# EAGLE board RouterPi (EAGLE 9.6.2)
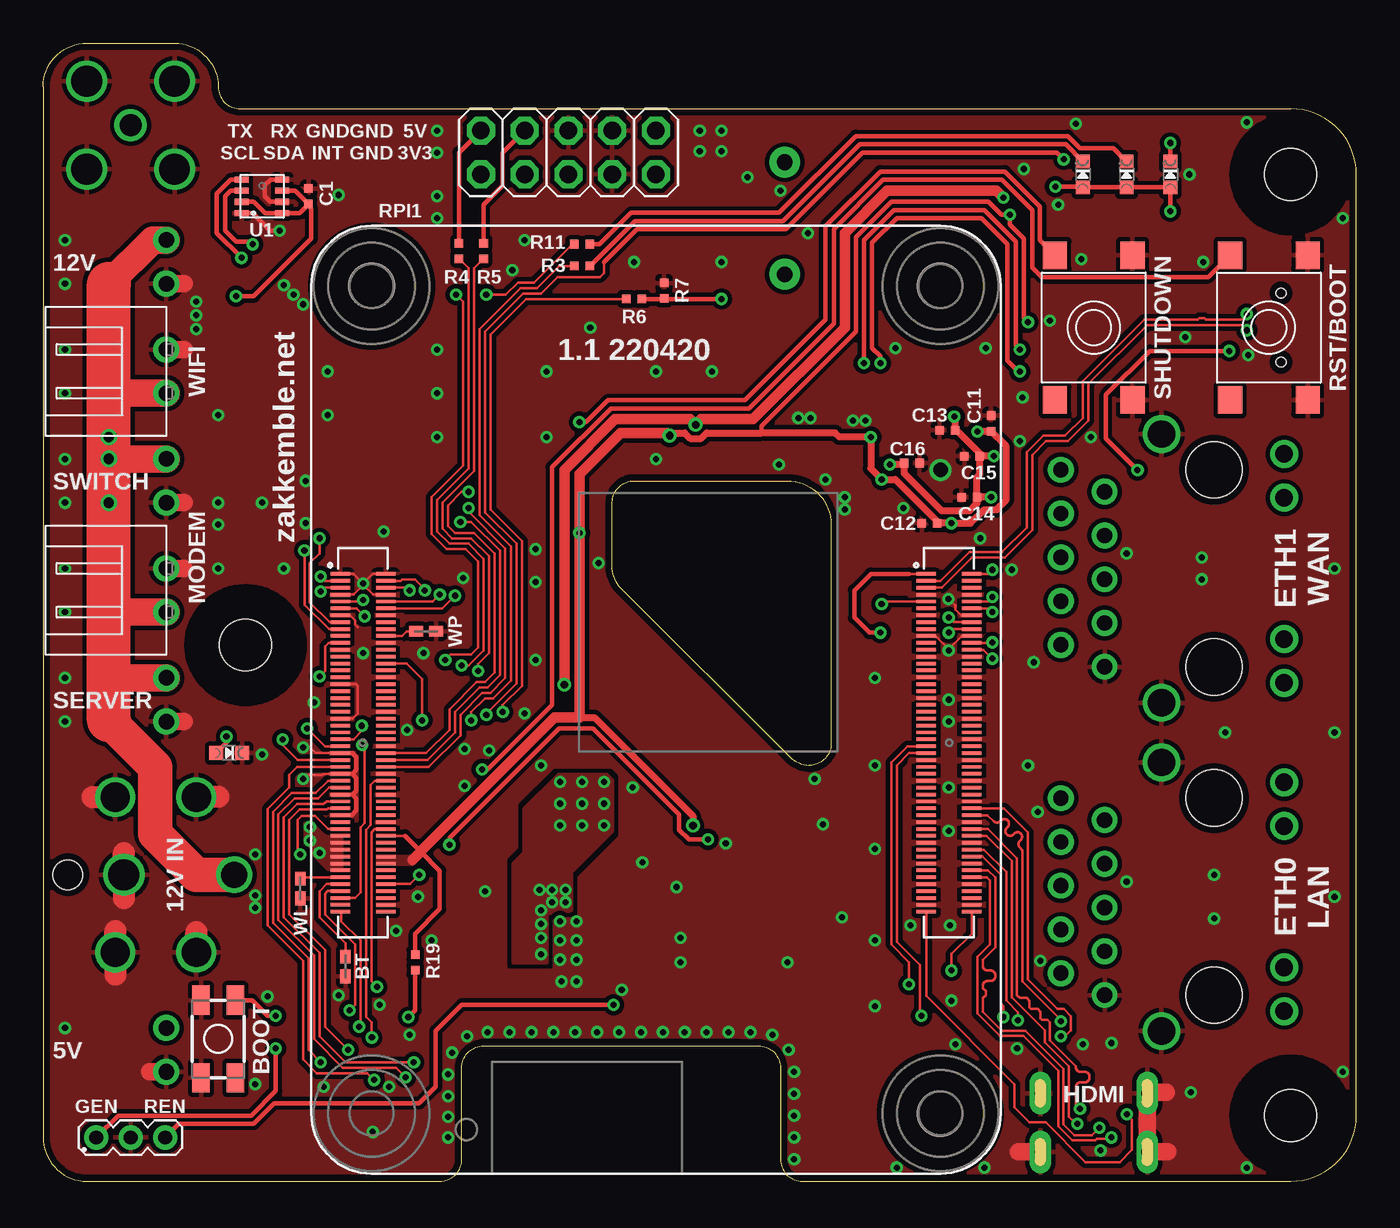
[diagram p2: board, top side]
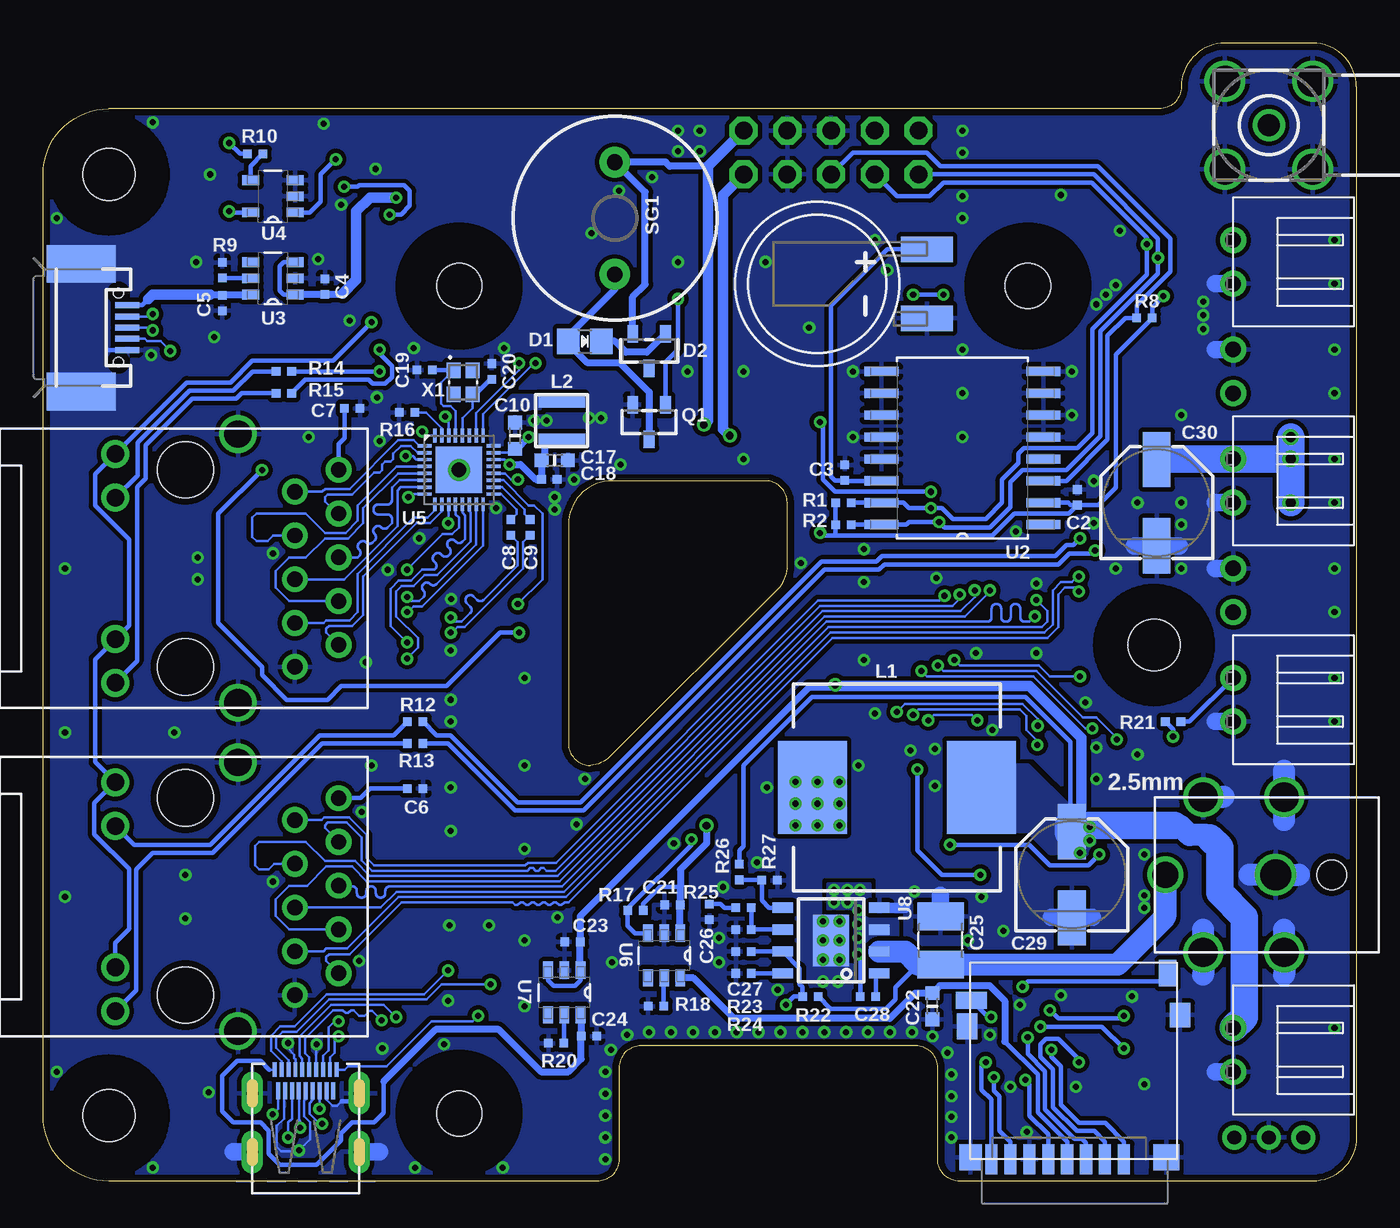
[diagram p3: board, bottom side, seen from below]

Size 76.2 x 66.04 mm. Coordinates in mm from the lower left corner, seen from the top.
Outline: 0,2.54 arc90 2.54,0 23.02,0 arc90 24.29,1.27 24.29,6.59 arc-90 25.56,7.86 41.51,7.86 arc-90 42.78,6.59 42.78,1.27 arc90 44.05,0 72.39,0 arc90 76.2,3.81 76.2,58.42 arc90 72.39,62.23 11.43,62.23 arc-90 10.16,63.5 arc90 7.62,66.04 2.54,66.04 arc90 0,63.5 0,2.54
Outline: 33.02,39.37 arc-90 34.29,40.64 43.18,40.64 arc-90 45.72,38.1 45.72,25.4 arc-90 44.45,24.13 arc-45 43.18,24.77 33.66,34.29 arc-45 33.02,35.56 33.02,39.37
Copper layers (1*16): Top 0.0356mm / dielectric 1.5011mm / Bottom 0.0356mm
Design rules "LaenPCBOrder *": minimum track width 6mil, minimum drill 13mil, track to track 6mil, track to pad 6mil, pad to pad 6mil, via to via 6mil, smd to smd 6mil, copper to edge 15mil, drill to drill 6mil, minimum pad ring 12mil, minimum via ring 7mil, stop-mask expansion 4mil, vias tented up to drill 24mil, thermal gap 10mil
Holes 3 mm at 72.39,58.42 11.75,31.11 72.39,3.81
Holes 2.6 mm at 52.06,3.94 19.06,51.94 52.06,51.94
tRestrict: area 69.2,55.2 to 75.6,61.6; area 8.6,27.9 to 14.9,34.3; area 69.2,0.6 to 75.6,7; area 25.4,0 to 40.4,8; area 48.7,0.6 to 55.4,7.3; area 15.7,48.6 to 22.4,55.3; area 48.7,48.6 to 55.4,55.3
bRestrict: area 69.2,55.2 to 75.6,61.6; area 8.6,27.9 to 14.9,34.3; area 69.2,0.6 to 75.6,7; area 25.4,0 to 40.4,8; area 48.7,0.6 to 55.4,7.3; area 15.7,48.6 to 22.4,55.3; area 48.7,48.6 to 55.4,55.3

## Footprints (pad centres in the part's own frame; a part is rotated, then mirrored left to right if it is on the bottom)
BATTERY_CR927 = smd 1.5 x 3: B+ 2,-6.35; B- -2,-6.35
0402_XSMALL = smd 0.5 x 0.5: 1 -0.45,0; 2 0.45,0
_0603MP = smd 0.8 x 0.8: 1 -0.762,0; 2 0.762,0
1210K = smd 1.6 x 2.7: 1 -1.4,0; 2 1.4,0
PANASONIC_D = smd 3.2 x 1.6: + 2.5,0; - -2.5,0
0805_DIODE = smd 1.3 x 1.5: 1 -0.95,0; 2 0.95,0
SOT-23-SLIMPAD = smd 0.635 x 1.016: 1 -0.95,-1; 2 0.95,-1; 3 0,1
JUMPER_SMALL = smd 0.8 x 0.6: 1 -0.577,0; 2 0.577,0
POWER_JACK_PTH_HIGHCURRENT = drill 1.7: C1 -4.5,4.7; C2 -4.5,0; C3 4.5,4.7; C4 4.5,0 | drill 1.8: GND 0,4.2 | drill 1.5: PWR 0,-2.2 | hole 1.7: 0,7.45
2WAY = drill 0.9: P$1 -1.27,0; P$2 1.27,0
2X05 = drill 1.016 octagon: 1 -5.08,-1.27; 2 -5.08,1.27; 3 -2.54,-1.27; 4 -2.54,1.27; 5 0,-1.27; 6 0,1.27; 7 2.54,-1.27; 8 2.54,1.27; 9 5.08,-1.27; 10 5.08,1.27
HEADER_2.0_3WAY = drill 0.8: 1 -2,0; 2 0,0; 3 2,0
RJ45_MAG_MOLEX_93626 = drill 0.89: 1 -5.72,19.69; 2 -4.45,17.15; 3 -3.18,19.69; 4 -1.91,17.15; 5 -0.64,19.69; 6 0.63,17.15; 7 1.9,19.69; 8 3.17,17.15; 9 4.44,19.69; 10 5.71,17.15 | drill 1.02: 11 -6.64,6.73; 12 -4.1,6.73; 13 4.1,6.73; 14 6.64,6.73 | drill 1.58: TAB1 -7.795,13.85; TAB2 7.795,13.85 | hole 3.26: -5.72,10.8; 5.71,10.8
HDMI_MICRO2 = smd 0.23 x 0.85: 1 1.8,6.475; 3 1.4,6.475; 5 1,6.475; 7 0.6,6.475; 9 0.2,6.475; 11 -0.2,6.475; 13 -0.6,6.475; 15 -1,6.475; 17 -1.4,6.475; 19 -1.8,6.475 | smd 0.23 x 1: 2 1.6,5.25; 4 1.2,5.25; 6 0.8,5.25; 8 0.4,5.25; 10 0,5.25; 12 -0.4,5.25; 14 -0.8,5.25; 16 -1.2,5.25; 18 -1.6,5.25 | drill 0.65 long: TAB1 -3.1,5.11; TAB2 3.1,5.11; TAB3 -3.1,1.7; TAB4 3.1,1.7
BU-SMA-H = drill 1.27: 1 0,0 | drill 1.778: 2 -2.55,2.55; 3 2.55,2.55; 4 2.55,-2.55; 5 -2.55,-2.55
CDRH125 = smd 5.4 x 4: 1 0,4.9; 2 0,-4.9
INDUCTOR_3X3MM_SM = smd 0.8 x 2.7: P$1 -1.15,0; P$2 1.15,0
CHIPLED_0603_NOOUTLINE = smd 0.8 x 0.8: A 0,-0.75; C 0,0.75
SOT23-R = smd 0.635 x 1.016: 1 -0.95,-1; 2 0.95,-1; 3 0,1
RPI_CM4 = smd 0.2 x 1.14: 1 7.3,18.32; 2 7.3,15.68; 3 6.9,18.32; 4 6.9,15.68; 5 6.5,18.32; 6 6.5,15.68; 7 6.1,18.32; 8 6.1,15.68; 9 5.7,18.32; 10 5.7,15.68; 11 5.3,18.32; 12 5.3,15.68; 13 4.9,18.32; 14 4.9,15.68; 15 4.5,18.32; 16 4.5,15.68; 17 4.1,18.32; 18 4.1,15.68; 19 3.7,18.32; 20 3.7,15.68; 21 3.3,18.32; 22 3.3,15.68; 23 2.9,18.32; 24 2.9,15.68; 25 2.5,18.32; 26 2.5,15.68; 27 2.1,18.32; 28 2.1,15.68; 29 1.7,18.32; 30 1.7,15.68; 31 1.3,18.32; 32 1.3,15.68; 33 0.9,18.32; 34 0.9,15.68; 35 0.5,18.32; 36 0.5,15.68; 37 0.1,18.32; 38 0.1,15.68; 39 -0.3,18.32; 40 -0.3,15.68; 41 -0.7,18.32; 42 -0.7,15.68; 43 -1.1,18.32; 44 -1.1,15.68; 45 -1.5,18.32; 46 -1.5,15.68; 47 -1.9,18.32; 48 -1.9,15.68; 49 -2.3,18.32; 50 -2.3,15.68; 51 -2.7,18.32; 52 -2.7,15.68; 53 -3.1,18.32; 54 -3.1,15.68; 55 -3.5,18.32; 56 -3.5,15.68; 57 -3.9,18.32; 58 -3.9,15.68; 59 -4.3,18.32; 60 -4.3,15.68; 61 -4.7,18.32; 62 -4.7,15.68; 63 -5.1,18.32; 64 -5.1,15.68; 65 -5.5,18.32; 66 -5.5,15.68; 67 -5.9,18.32; 68 -5.9,15.68; 69 -6.3,18.32; 70 -6.3,15.68; 71 -6.7,18.32; 72 -6.7,15.68; 73 -7.1,18.32; 74 -7.1,15.68; 75 -7.5,18.32; 76 -7.5,15.68; 77 -7.9,18.32; 78 -7.9,15.68; 79 -8.3,18.32; 80 -8.3,15.68; 81 -8.7,18.32; 82 -8.7,15.68; 83 -9.1,18.32; 84 -9.1,15.68; 85 -9.5,18.32; 86 -9.5,15.68; 87 -9.9,18.32; 88 -9.9,15.68; 89 -10.3,18.32; 90 -10.3,15.68; 91 -10.7,18.32; 92 -10.7,15.68; 93 -11.1,18.32; 94 -11.1,15.68; 95 -11.5,18.32; 96 -11.5,15.68; 97 -11.9,18.32; 98 -11.9,15.68; 99 -12.3,18.32; 100 -12.3,15.68; 101 7.3,-15.68; 102 7.3,-18.32; 103 6.9,-15.68; 104 6.9,-18.32; 105 6.5,-15.68; 106 6.5,-18.32; 107 6.1,-15.68; 108 6.1,-18.32; 109 5.7,-15.68; 110 5.7,-18.32; 111 5.3,-15.68; 112 5.3,-18.32; 113 4.9,-15.68; 114 4.9,-18.32; 115 4.5,-15.68; 116 4.5,-18.32; 117 4.1,-15.68; 118 4.1,-18.32; 119 3.7,-15.68; 120 3.7,-18.32; 121 3.3,-15.68; 122 3.3,-18.32; 123 2.9,-15.68; 124 2.9,-18.32; 125 2.5,-15.68; 126 2.5,-18.32; 127 2.1,-15.68; 128 2.1,-18.32; 129 1.7,-15.68; 130 1.7,-18.32; 131 1.3,-15.68; 132 1.3,-18.32; 133 0.9,-15.68; 134 0.9,-18.32; 135 0.5,-15.68; 136 0.5,-18.32; 137 0.1,-15.68; 138 0.1,-18.32; 139 -0.3,-15.68; 140 -0.3,-18.32; 141 -0.7,-15.68; 142 -0.7,-18.32; 143 -1.1,-15.68; 144 -1.1,-18.32; 145 -1.5,-15.68; 146 -1.5,-18.32; 147 -1.9,-15.68; 148 -1.9,-18.32; 149 -2.3,-15.68; 150 -2.3,-18.32; 151 -2.7,-15.68; 152 -2.7,-18.32; 153 -3.1,-15.68; 154 -3.1,-18.32; 155 -3.5,-15.68; 156 -3.5,-18.32; 157 -3.9,-15.68; 158 -3.9,-18.32; 159 -4.3,-15.68; 160 -4.3,-18.32; 161 -4.7,-15.68; 162 -4.7,-18.32; 163 -5.1,-15.68; 164 -5.1,-18.32; 165 -5.5,-15.68; 166 -5.5,-18.32; 167 -5.9,-15.68; 168 -5.9,-18.32; 169 -6.3,-15.68; 170 -6.3,-18.32; 171 -6.7,-15.68; 172 -6.7,-18.32; 173 -7.1,-15.68; 174 -7.1,-18.32; 175 -7.5,-15.68; 176 -7.5,-18.32; 177 -7.9,-15.68; 178 -7.9,-18.32; 179 -8.3,-15.68; 180 -8.3,-18.32; 181 -8.7,-15.68; 182 -8.7,-18.32; 183 -9.1,-15.68; 184 -9.1,-18.32; 185 -9.5,-15.68; 186 -9.5,-18.32; 187 -9.9,-15.68; 188 -9.9,-18.32; 189 -10.3,-15.68; 190 -10.3,-18.32; 191 -10.7,-15.68; 192 -10.7,-18.32; 193 -11.1,-15.68; 194 -11.1,-18.32; 195 -11.5,-15.68; 196 -11.5,-18.32; 197 -11.9,-15.68; 198 -11.9,-18.32; 199 -12.3,-15.68; 200 -12.3,-18.32
MICROSD = smd 0.7 x 1.75: 1 8.9,0; 2 7.8,0; 3 6.7,0; 4 5.6,0; 5 4.5,0; 6 3.4,0; 7 2.3,0; 8 1.2,0 | smd 1.8 x 1: CD1 0.05,9.225 | smd 1 x 1.55: CD2 11.43,10.8 | smd 1.2 x 1.5: G1 -0.2,7.725 | smd 1.2 x 1.4: G2 12.15,8.375 | smd 1.3 x 1.5: G3 0,0.125 | smd 1.5 x 1.5: G4 11.35,0.125
BUZZER-12MM = drill 0.9 pad 1.778: + 3.25,0; - -3.25,0
TACT_SMD4 = smd 1.6 x 1.4: A -4.2,-2.25; A' 4.2,-2.25; B -4.2,2.25; B' 4.2,2.25
TACT_SMD5 = smd 1.7 x 1: 1 -2.25,1; 2 2.25,1; 3 -2.25,-1; 4 2.25,-1
BME280 = smd 0.8 x 0.35: 1 1.175,0.975; 2 1.175,0.325; 3 1.175,-0.325; 4 1.175,-0.975; 5 -1.175,-0.975; 6 -1.175,-0.325; 7 -1.175,0.325; 8 -1.175,0.975
SOIC127P1032X265-16N = smd 1.981 x 0.533: 1 -4.699,4.445; 2 -4.699,3.175; 3 -4.699,1.905; 4 -4.699,0.635; 5 -4.699,-0.635; 6 -4.699,-1.905; 7 -4.699,-3.175; 8 -4.699,-4.445; 9 4.699,-4.445; 10 4.699,-3.175; 11 4.699,-1.905; 12 4.699,-0.635; 13 4.699,0.635; 14 4.699,1.905; 15 4.699,3.175; 16 4.699,4.445
SOT23-6_SM_PAD = smd 1 x 0.56: 1 -1.295,0.94; 2 -1.295,0; 3 -1.295,-0.94; 4 1.295,-0.94; 5 1.295,0; 6 1.295,0.94
SOT23-5_SM_PAD = smd 1 x 0.56: 1 -1.295,0.94; 2 -1.295,0; 3 -1.295,-0.94; 4 1.295,-0.94; 5 1.295,0.94
QFN32-4X4-0.4 = smd 0.8 x 0.2: 1 -2,1.4; 2 -2,1; 3 -2,0.6; 4 -2,0.2; 5 -2,-0.2; 6 -2,-0.6; 7 -2,-1; 8 -2,-1.4; 17 2,-1.4; 18 2,-1; 19 2,-0.6; 20 2,-0.2; 21 2,0.2; 22 2,0.6; 23 2,1; 24 2,1.4 | smd 0.2 x 0.8: 9 -1.4,-2; 10 -1,-2; 11 -0.6,-2; 12 -0.2,-2; 13 0.2,-2; 14 0.6,-2; 15 1,-2; 16 1.4,-2; 25 1.4,2; 26 1,2; 27 0.6,2; 28 0.2,2; 29 -0.2,2; 30 -0.6,2; 31 -1,2; 32 -1.4,2 | smd 2.7 x 2.7: EXP 0,0
SOIC8_150MIL_EXPPAD = smd 0.6 x 1.2: 1 -1.905,-2.8; 2 -0.635,-2.8; 3 0.635,-2.8; 4 1.905,-2.8; 5 1.905,2.8; 6 0.635,2.8; 7 -0.635,2.8; 8 -1.905,2.8 | smd 3 x 2.1: EXPPAD 0,0
USB-MICROB_LARGEPAD = smd 0.35 x 1.4: D+ 0,2.65; D- -0.65,2.65; GND 1.3,2.65; ID 0.65,2.65; VBUS -1.3,2.65 | smd 2.2 x 4: MT1 -3.7,0; MT2 3.7,0 | hole 0.55: -2,2.15; 2,2.15
2016_XTAL = smd 0.9 x 0.8: 1 -0.7,-0.55; 2 0.7,-0.55; 3 0.7,0.55; 4 -0.7,0.55

## Placement (x,y rotation side)
BATT1  [BATTERY_CR927]  31.27,52.07 90 bottom
C1  100n  [0402_XSMALL]  15.4,57.15 90 top
C2  100n  [0402_XSMALL]  16.19,39.69 90 bottom
C3  100n  [0402_XSMALL]  29.69,41.12 90 bottom
C4  100n  [0402_XSMALL]  59.85,51.91 90 bottom
C5  100n  [0402_XSMALL]  65.8,50.96 270 bottom
C6  100n  [0402_XSMALL]  54.61,22.78 0 bottom
C7  100n  [0402_XSMALL]  58.26,44.85 0 bottom
C8  100n  [0402_XSMALL]  49.05,37.94 90 bottom
C9  100n  [0402_XSMALL]  47.94,37.94 90 bottom
C10  4u7  [_0603MP]  48.82,43.26 90 bottom
C11  100n  [0402_XSMALL]  55.01,43.97 90 top
C12  100n  [0402_XSMALL]  51.43,38.18 180 top
C13  100n  [0402_XSMALL]  52.47,43.58 180 top
C14  100n  [0402_XSMALL]  53.74,39.69 180 top
C15  100n  [0402_XSMALL]  53.9,42.07 180 top
C16  100n  [0402_XSMALL]  50.4,41.67 0 top
C17  4u7  [_0603MP]  46.51,41.83 0 bottom
C18  100n  [0402_XSMALL]  46.83,40.72 0 bottom
C19  6p8  [0402_XSMALL]  54.05,47.07 180 bottom
C20  6p8  [0402_XSMALL]  50.16,46.99 90 bottom
C21  100n  [0402_XSMALL]  39.69,16.03 180 bottom
C22  4u7  [_0603MP]  24.61,10.16 270 bottom
C23  100n  [0402_XSMALL]  45.48,13.89 180 bottom
C24  100n  [0402_XSMALL]  44.53,8.41 0 bottom
C25  22u  [1210K]  24.13,13.97 90 bottom
C26  1n  [0402_XSMALL]  37.54,15.64 270 bottom
C27  33p  [0402_XSMALL]  35.56,14.61 180 bottom
C28  100n  [0402_XSMALL]  28.34,10.72 180 bottom
C29  270u  [PANASONIC_D]  16.51,17.78 90 bottom
C30  270u  [PANASONIC_D]  11.59,39.37 90 bottom
D1  TS4148  [0805_DIODE]  44.77,48.74 0 bottom
D2  15V  [SOT-23-SLIMPAD]  41.04,48.18 180 bottom
J2  [JUMPER_SMALL]  14.92,16.99 90 top
J3  [JUMPER_SMALL]  17.54,12.46 90 top
J4  [JUMPER_SMALL]  22.23,31.91 180 top
JP1  [POWER_JACK_PTH_HIGHCURRENT]  8.89,17.78 270 bottom
JP2  [2WAY]  7.14,27.94 270 bottom
JP3  [2WAY]  7.14,34.29 90 top
JP4  [2WAY]  7.14,40.64 270 bottom
JP5  [2WAY]  7.14,46.99 90 top
JP6  [2WAY]  7.14,53.34 270 bottom
JP7  [2WAY]  7.14,7.62 270 bottom
JP8  [2X05]  30.48,59.69 0 top
JP9  [HEADER_2.0_3WAY]  5.08,2.54 0 top
JP10  [RJ45_MAG_MOLEX_93626]  78.74,16.51 270 bottom
JP11  [RJ45_MAG_MOLEX_93626]  78.74,35.56 270 bottom
JP12  [HDMI_MICRO2]  60.96,0 0 bottom
JP13  BU-SMA-H  [BU-SMA-H]  5.08,61.28 0 bottom
L1  18u  [CDRH125]  26.67,22.86 90 bottom
L2  2u2  [INDUCTOR_3X3MM_SM]  46.12,44.13 90 bottom
LED1  [CHIPLED_0603_NOOUTLINE]  60.32,58.42 0 top
LED2  [CHIPLED_0603_NOOUTLINE]  65.41,58.42 0 top
LED3  [CHIPLED_0603_NOOUTLINE]  62.87,58.42 0 top
LED4  [CHIPLED_0603_NOOUTLINE]  10.79,24.84 270 top
Q1  BC817-40  [SOT23-R]  41.04,44.05 180 bottom
R1  10k  [0402_XSMALL]  29.77,39.37 180 bottom
R2  10k  [0402_XSMALL]  29.77,38.1 180 bottom
R3  1k  [0402_XSMALL]  31.27,53.1 0 top
R4  1k  [0402_XSMALL]  24.13,53.98 270 top
R5  1k  [0402_XSMALL]  25.56,53.98 270 top
R6  2k2  [0402_XSMALL]  34.29,51.2 180 top
R7  47k  [0402_XSMALL]  36.04,51.67 90 top
R8  10k  [0402_XSMALL]  12.3,50.09 0 bottom
R9  22k  [0402_XSMALL]  65.8,52.86 90 bottom
R10  1k  [0402_XSMALL]  63.9,59.61 180 bottom
R11  1k  [0402_XSMALL]  31.27,54.37 0 top
R12  330  [0402_XSMALL]  54.61,26.67 0 bottom
R13  330  [0402_XSMALL]  54.61,25.4 0 bottom
R14  330  [0402_XSMALL]  62.23,46.99 0 bottom
R15  330  [0402_XSMALL]  62.23,45.72 0 bottom
R16  2k49  [0402_XSMALL]  55.09,44.61 0 bottom
R17  10k  [0402_XSMALL]  41.83,15.72 0 bottom
R18  22k  [0402_XSMALL]  40.64,10.16 180 bottom
R19  0R  [0402_XSMALL]  21.59,12.7 270 top
R20  43k  [0402_XSMALL]  46.43,8.02 180 bottom
R21  10k  [0402_XSMALL]  10.64,26.67 0 bottom
R22  220k  [0402_XSMALL]  31.67,10.72 0 bottom
R23  62k  [0402_XSMALL]  35.56,13.34 0 bottom
R24  180k  [0402_XSMALL]  35.56,12.06 0 bottom
R25  24k  [0402_XSMALL]  35.56,15.88 0 bottom
R26  120k  [0402_XSMALL]  35.8,17.94 90 bottom
R27  22k  [0402_XSMALL]  34.05,17.46 180 bottom
RPI1  [RPI_CM4]  35.56,27.94 90 top
SD1  MICROSD  [MICROSD]  22.38,1.27 0 bottom
SG1  [BUZZER-12MM]  43.02,55.88 90 bottom
SW1  [TACT_SMD4]  60.96,49.53 90 top
SW2  [TACT_SMD4]  71.12,49.53 90 top
SW3  [TACT_SMD5]  10.16,8.26 90 top
U1  BME280  [BME280]  12.7,57.15 180 top
U2  DS3231  [SOIC127P1032X265-16N]  22.86,42.55 180 bottom
U3  AP2553W6-7  [SOT23-6_SM_PAD]  62.87,52.39 180 bottom
U4  74LVC1G32W5-7  [SOT23-5_SM_PAD]  62.87,57.15 180 bottom
U5  RTL8111H  [QFN32-4X4-0.4]  52.07,41.27 0 bottom
U6  AP2553W6-7  [SOT23-6_SM_PAD]  40.16,13.1 270 bottom
U7  AP2553W6-7  [SOT23-6_SM_PAD]  45.96,10.95 270 bottom
U8  TPS54335A  [SOIC8_150MIL_EXPPAD]  30.48,13.97 90 bottom
USB1  USB-MICROBLARGEPAD  [USB-MICROB_LARGEPAD]  73.98,49.53 270 bottom
X1  25MHz  [2016_XTAL]  51.83,46.35 270 bottom

## Tracks (layer width: path | path; a pad name or v marks a point on that pad's centre or on a via)
3.3V  (via drill 0.35, 0.45)
  Top 0.152: RPI1.78 21,20.04
  Top 0.254: U1.2 12.23,56.83 12.88,56.17 U1.8 14.87,56.17 C1.1 | v57.15,49.85 56.91,50.09 56.91,54.69 56.09,55.51 v56.09,56.09 55.59,56.09 54.85,56.83 49.21,56.83 47.15,54.77 47.15,49.29 41.67,43.81 41.67,43.42 | v11.19,51.36 12.22,51.36 15.56,54.69 15.56,56.44 15.4,56.59 C1.1 | 21,20.04 21.87,19.17 21.87,19.09 | R19.1 21.59,14.37 23.02,15.8 23.02,18.02 21.91,19.13 | v58.74,57.71 60.29,57.71 LED1.A LED3.A LED2.A v65.41,56.28 | U1.6 14.62,57.48 C1.1
  Top 0.406: 36.2,43.42 37.23,43.42 37.54,43.1 38.18,43.1 38.5,43.42 41.67,43.42 45.96,43.42 46.2,43.18 v48.02,43.18 48.02,41.35 v48.66,40.72 49.45,40.72 51.88,38.28 C12.1 v52.7,38.18 53.82,38.18 54.61,38.97 55.32,38.97 55.88,39.53 55.88,42.65 C11.1 54.24,43.52 v54.21,43.5 | v37.7,20.64 37.7,21.19 31.99,26.91 31.12,26.91 31.04,26.91
  Top 0.61: v36.35,43.26 36.2,43.42 33.5,43.42 31.12,41.04 v31.12,37.62 31.12,26.91 | 21.43,18.65 21.87,19.09 21.91,19.13 29.69,26.91 31.04,26.91
  Bottom 0.152: U5.32 53.99,43.27 v54.21,43.5 | v52.7,38.18 52.67,38.21 U5.11 | v48.66,40.72 49.05,40.72 49.41,41.08 U5.20 | JP11.11 | JP10.11 | U5.23 49.04,42.27 C10.1
  Bottom 0.254: JP11.11 73.18,41.04 73.18,39.21 71.22,37.24 71.22,32.25 JP11.13 73.18,30.29 73.18,24.32 JP10.11 73.22,21.95 73.22,20.12 71.22,18.11 71.22,14.63 72.01,13.84 JP10.13 | JP11.11 67.86,46.35 65.33,46.35 64.06,47.62 59.37,47.62 v57.15,49.85 | v31.12,37.62 30.96,37.47 30.22,37.47 | 30.22,37.47 21.11,37.47 19.84,38.73 16.7,38.73 C2.1 | v56.09,56.09 55.43,56.09 54.93,56.59 54.93,57.47 55.24,57.78 57.86,57.78 57.94,57.71 v58.74,57.71 | 39.22,17.07 40.41,17.07 41.38,16.09 R17.2 | U4.5 65.34,56.21 v65.41,56.28 | C2.1 14.98,39.24 13.97,40.24 13.97,47.97 R8.2 11.85,50.69 v11.19,51.36 | C2.1 16.59,39.24 16.72,39.37 U2.2 | R1.2 R2.2 30.22,37.47
  Bottom 0.406: v37.7,20.64 37.7,19.61 39.22,18.09 39.22,17.07 39.22,16.05 C21.1 39.24,14.41 U6.1 | C10.1 48.7,42.5 v48.02,43.18
  Bottom 0.61: v36.35,43.26 36.75,43.66 36.75,57.23 JP8.9
  pour Top (rank 5, no thermals): 19.37,18.41 19.37,18.81 21.43,18.81 21.51,18.73 21.51,18.49 21.43,18.41
5.0V  (via drill 0.35, 0.45)
  Top 0.61: v30.24,28.81 30.24,41.27 33.18,44.21 37.54,44.21 v37.86,43.89 38.18,44.21 41.2,44.21 46.51,49.53 46.51,55.01 48.97,57.47 55.32,57.47 v55.72,57.07
  Bottom 0.152: 45.01,12.24 U7.1 | 61.58,53.34 U3.3
  Bottom 0.254: U7.3 46.9,11.65 46.59,11.35 45.32,11.35 45.01,11.67 45.01,12.24 | 15.95,21.59 16.59,20.95 16.59,25.48 19.21,28.1 31.59,28.1 35.56,24.13 35.56,19.44 35.8,19.2 R26.2 | U3.1 62.24,51.45 62.47,51.67 62.47,53.1 62.23,53.34 61.58,53.34 | SG1.+
  Bottom 0.406: v30.24,28.81 30.4,28.65 31.75,28.65 45.03,15.37 C23.1 45.03,12.26 U7.1 | 37.63,58.89 39.84,58.89 40.08,59.13 SG1.+ 41.27,57.39 41.27,52.04 41.99,51.32 D2.2 | U3.1 61.56,51.46 C4.1 58.87,51.46 58.82,51.51
  Bottom 0.61: 15.95,21.59 15.95,25.72 18.97,28.73 30.16,28.73 v30.24,28.81 | v37.86,43.89 37.63,44.13 37.63,58.89 JP8.10 | 58.82,51.51 58.02,52.31 58.02,56.28 57.23,57.07 v55.72,57.07
  Bottom 1.27: 8.49,19.92 8.65,20.08 9.68,20.08 10.24,20.64 10.56,20.64
  Bottom 1.6: JP7.P$1 6.51,9.53 6.51,15.32 7.94,16.75 7.94,19.37 8.49,19.92 | 10.56,20.64 16.51,20.64
  Bottom 2: 16.51,20.64 C29.+
  other vias: 15.48,20.56 15.48,19.76 16.03,19.05
  pour Bottom (rank 5, no thermals): 20.32,24.13 19.05,24.13 16.51,21.59 16.51,19.05 17.78,19.05 19.05,20.32 20.32,20.32
  pour Top (isolate 0.254, rank 4, no thermals): 17.3,20.88 17.3,18.02 16.67,18.02 15.24,19.45 15.24,20.88
  pour Bottom (isolate 0.254, rank 5, no thermals): 15.95,18.73 15.24,19.45 15.24,20.88 15.48,21.11 17.07,21.11 17.07,18.73
12V  (via drill 0.6)
  Top 1.6: 3.81,52.07 6.35,54.61 JP6.P$1 | JP5.P$1 3.81,45.72 | JP4.P$1 v3.81,41.91 | JP3.P$1 3.81,33.02 | JP2.P$1 3.81,29.21
  Top 2: JP1.PWR 8.89,17.78 6.51,20.16 6.51,24.05 3.81,26.75
  Top 2.54: 3.81,26.75 3.81,29.21 3.81,33.02 v3.81,41.91 3.81,45.72 3.81,52.07
  Bottom 0.254: 25.43,12.57 26.75,11.25 26.75,10.56 27.3,10 30.51,10 R22.2 | R21.2 9.68,26.67 JP2.P$1
  Bottom 1.27: U8.2 26.19,13.34 25.43,12.57 C25.1 13.86,12.57 11.09,15.34 JP1.PWR
  Bottom 1.6: C30.+ 11.55,41.91 JP4.P$1 v3.81,41.91 | v3.81,43.18 v3.81,41.91 | v3.81,39.37 v3.81,41.91
GND  (via drill 0.35, 0.85)
  Top 0.152: v15.08,23.34 15.32,23.57 16.19,23.57 16.26,23.64 RPI1.59 17.95,23.64 | RPI1.71 17.91,21.24 | RPI1.65 17.96,22.44 | v15.08,25.16 15.48,25.16 15.8,24.84 RPI1.53 17.94,24.84 | RPI1.114 53.28,32.84 52.93,33.19 52.93,33.39 v52.54,33.79 | RPI1.8 19.14,34.04 18.57,34.61 | 18.57,34.61 v18.57,34.69 | RPI1.7 18.01,34.04 18.57,34.61 | RPI1.43 17.95,26.84 18.26,27.15 18.26,28.73 18.15,28.84 RPI1.33 | RPI1.13 17.8,32.84 18.1,32.54 18.1,32.31 18.26,32.15 | RPI1.120 53.31,31.64 52.55,30.88 | 52.55,30.88 v52.55,30.8 | RPI1.119 51.78,31.64 52.55,30.88 | RPI1.1 18.02,35.24 v18.57,34.69 | RPI1.2 19.13,35.24 v18.57,34.69
  Top 0.254: U1.7 13.18,56.83 12.86,57.15 12.86,57.78 13.2,58.12 U1.5 | 17.91,21.24 18.18,21.51 18.18,22.23 17.96,22.44 18.18,22.66 18.18,23.42 17.95,23.64 18.18,23.86 18.18,24.61 17.94,24.84 | U1.1 12.17,56.17 13.18,55.17 v13.73,55.17
  Top 1.016: JP3.P$2 8.18,35.56 | JP4.P$2 8.18,39.37 | JP5.P$2 8.18,48.26 | JP6.P$2 8.18,52.07 | JP2.P$2 8.18,26.67 | JP7.P$2 6.19,6.35 | JP12.TAB4 56.59,1.7 | 65.17,5.16 64.06,5.16 JP12.TAB1 JP12.TAB3 65.25,1.7
  Top 1.27: 10.16,22.3 8.91,22.3 JP1.C2 | JP1.C4 8.89,14.45 | 4.69,16.43 JP1.GND 4.69,19.05 | 4.19,14.53 JP1.C3 4.19,11.99 | JP1.C1 2.86,22.28
  Bottom 0.152: 58.87,4.63 59.13,4.37 59.41,4.37 59.76,4.71 JP12.4 | JP12.7 60.36,7.9 v60.32,7.94 | JP12.13 61.56,7.08 61.62,7.14 61.62,7.33 61.99,7.7 v61.99,8.02 | JP12.10 60.96,4.75 61.05,4.65 61.05,3.77 60.7,3.42 60.7,2.45 v61.36,1.79 61.4,1.75 62.39,1.75 62.64,2 62.64,3.21 62.22,3.64 62.22,5.19 JP12.16
  Bottom 0.254: 58.87,4.63 58.34,4.63 JP12.TAB2 | USB1.GND 72.42,48.23
  Bottom 0.61: U8.4 26.19,15.88
  Bottom 1.016: 8.18,35.56 JP3.P$2 | 8.18,39.37 JP4.P$2 | 8.18,48.26 JP5.P$2 | 8.18,52.07 JP6.P$2 | 8.18,26.67 JP2.P$2 | 8.18,6.35 JP7.P$2 | C25.2 24.13,16.59 | 15.32,15.32 16.47,15.32 C29.- 16.55,15.32 17.7,15.32 | 12.9,36.87 C30.- 10.28,36.87 | JP12.TAB4 56.67,1.7 | JP12.TAB3 65.17,1.7
  Bottom 1.27: JP1.C2 8.87,22.3 7.7,22.3 | 8.89,14.61 JP1.C4 8.89,11.99 | 3.33,17.78 JP1.GND 6.19,17.78 | 4.19,23.81 JP1.C1 4.21,22.28 4.21,20.95 | 4.19,14.61 JP1.C3 4.19,11.99
  other vias: 30,13.97 30.96,13.97 30,15.08 30.96,15.08 30.96,12.86 30,12.86 30.08,11.59 30.96,11.59 66.6,5.16 52.07,41.27 47.7,44.13 46.51,39.69 49.93,39.05 19.13,2.86 46.99,44.13 54.69,48.34 50.32,14.84 52.63,14.84 52.7,10.48 17.15,10.79 21.11,26.19 18.57,30.64 24.45,25.08 25.88,25 27.94,27.15 24.45,22.94 15.72,27.78 57.47,30.12 28.57,30.24 28.57,34.77 22.07,30.64 12.3,18.97 12.3,16.59 19.53,10.24 20.48,14.53 21.75,16.51 12.3,15.88 34.77,18.49 36.75,17.07 36.99,14.13 33.58,11.11 36.99,12.7 21.27,8.49 24.37,35 40.88,58.26 38.1,60.96 44.37,55.01 56.91,58.74 59.93,61.36 58.42,49.93 56.83,45.48 69.85,61.44 75.41,55.88 75.41,6.35 69.85,0.79 43.58,1.27 43.58,2.54 43.58,3.81 43.58,5.08 43.58,6.35 43.26,7.62 38.5,8.65 37.23,8.65 23.49,2.54 23.49,3.73 23.49,4.92 41.04,8.65 42.31,8.49 39.77,8.65 49.53,0.79 54.61,0.79 45.24,20.72 48.26,19.29 52.55,20.32 52.55,22.86 52.55,26.67 52.55,27.94 28.57,36.67 29.21,43.18 29.21,46.99 31.75,49.53 35.56,46.99 35.56,41.91 32.23,35.88 42.7,41.59 49.45,48.34 69.93,47.94 67.23,36.2 74.93,35.56 67.95,17.78 74.93,16.51 48.26,24.13 54.37,37.31 56.2,35.48 60.8,43.18 16.51,46.99 16.51,44.45 15.24,40.64 22.86,48.26 13.97,35.56 1.27,54.61 1.27,48.26 1.27,41.91 1.27,35.56 1.27,29.21 1.27,8.89 16.27,5.48 57.15,24.13 43.18,12.7 48.26,13.97 39.37,53.34 42.78,57.47 25.64,16.83 22.54,13.97 28.89,24.13 34.21,22.86 22.86,55.88 22.86,60.96 27.94,54.61 34.29,53.34 38.81,46.99 13.02,10.72 43.81,44.29 44.53,44.29 46.51,38.97 45.4,40.72 74.93,26.04 68.58,26.04 39.61,19.61 48.26,10.16 48.26,29.21 67.31,53.34 12.7,24.77 38.1,59.77 39.37,60.96 39.37,59.77 22.86,45.72 22.86,43.18 57.86,12.78 57.71,21.43 67.23,34.92 67.95,15.24 66.28,48.97 56.52,7.7 52.94,7.94 12.3,5.64 44.77,23.34 46.35,15.32 56.67,42.94 62.87,36.43 62.87,17.38 58.9,56.67 60.25,53.5 66.52,58.42 19.76,37.7 15.24,38.18 27.23,52.86 17.15,57.23 10.16,35.56 10.16,38.1 12.7,39.37 10.16,39.37 10.16,44.45 13.97,51.99 14.53,51.44 15.08,50.88 8.89,51.04 8.89,50.24 8.89,49.45 1.27,39.37 1.27,33.02 1.27,26.67 1.27,45.72 1.27,52.07 22.86,57.15 22.86,59.69 23.49,6.19 23.73,7.46 20.08,5.48 25.8,8.65 33.42,8.65 32.15,8.65 30.88,8.65 29.61,8.65 28.34,8.65 27.07,8.65 34.69,8.65 35.96,8.65 24.61,8.41
  pour Top (isolate 0.254, rank 6): 0,66.04 76.2,66.04 76.2,0 0,0
  pour Bottom (isolate 0.254, rank 6): 76.2,66.04 0,66.04 0,0 76.2,0
  pour Bottom (isolate 0.254, rank 6, no thermals): 31.91,15.88 29.05,15.88 29.05,12.06 31.91,12.06
  pour Top (rank 5, no thermals): 18.97,31.35 20.8,31.35 20.8,31.11 18.97,31.11
  pour Top (rank 5, no thermals): 18.97,29.35 20.8,29.35 20.8,29.11 18.97,29.11
  pour Top (rank 5, no thermals): 18.97,27.35 20.8,27.35 20.8,27.11 18.97,27.11
  pour Top (rank 5, no thermals): 19.21,25.35 20.88,25.35 20.88,25.11 19.21,25.11
  pour Top (rank 5, no thermals): 19.21,23.75 20.88,23.75 20.88,23.52 19.21,23.52
  pour Top (rank 5, no thermals): 18.97,22.55 20.8,22.55 20.8,22.32 18.97,22.32
  pour Top (rank 5, no thermals): 18.97,20.95 20.8,20.95 20.8,20.71 18.97,20.71
  pour Top (rank 5, no thermals): 19.37,16.15 20.8,16.15 20.8,15.91 19.37,15.91
  pour Top (rank 5, no thermals): 19.29,32.95 20.88,32.95 20.88,32.72 19.29,32.72
  pour Top (rank 5, no thermals): 19.29,34.15 20.64,34.15 20.64,33.91 19.29,33.91
  pour Top (rank 5, no thermals): 16.35,26.96 18.02,26.96 18.02,26.72 16.35,26.72
  pour Top (rank 5, no thermals): 16.35,28.94 18.18,28.94 18.18,28.7 16.35,28.7
  pour Top (rank 5, no thermals): 16.35,31 18.18,31 18.18,30.69 16.35,30.69
  pour Top (rank 5, no thermals): 53.02,28.15 54.85,28.15 54.85,27.91 53.02,27.91
  pour Top (rank 5, no thermals): 53.02,29.35 54.85,29.35 54.85,29.11 53.02,29.11
  pour Top (rank 5, no thermals): 53.02,30.55 54.85,30.55 54.85,30.31 53.02,30.31
  pour Top (rank 5, no thermals): 53.02,26.95 54.85,26.95 54.85,26.71 53.02,26.71
  pour Top (rank 5, no thermals): 53.02,25.75 54.85,25.75 54.85,25.51 53.02,25.51
  pour Top (rank 5, no thermals): 53.02,24.55 54.85,24.55 54.85,24.31 53.02,24.31
  pour Top (rank 5, no thermals): 53.02,23.35 54.85,23.35 54.85,23.11 53.02,23.11
  pour Top (rank 5, no thermals): 53.02,22.15 54.85,22.15 54.85,21.91 53.02,21.91
  pour Top (rank 5, no thermals): 53.02,20.95 54.85,20.95 54.85,20.71 53.02,20.71
  pour Top (rank 5, no thermals): 53.02,19.75 54.85,19.75 54.85,19.51 53.02,19.51
  pour Top (rank 5, no thermals): 53.02,18.55 54.85,18.55 54.85,18.31 53.02,18.31
  pour Top (rank 5, no thermals): 53.02,17.35 54.85,17.35 54.85,17.11 53.02,17.11
  pour Top (rank 5, no thermals): 53.02,16.15 54.85,16.15 54.85,15.91 53.02,15.91
  pour Top (rank 5, no thermals): 50.22,16.15 52.05,16.15 52.05,15.91 50.22,15.91
  pour Top (rank 5, no thermals): 50.22,17.35 52.05,17.35 52.05,17.11 50.22,17.11
  pour Top (rank 5, no thermals): 50.22,18.55 52.05,18.55 52.05,18.31 50.22,18.31
  pour Top (rank 5, no thermals): 50.22,19.75 52.05,19.75 52.05,19.51 50.22,19.51
  pour Top (rank 5, no thermals): 50.22,20.95 52.05,20.95 52.05,20.71 50.22,20.71
  pour Top (rank 5, no thermals): 50.22,22.15 52.05,22.15 52.05,21.91 50.22,21.91
  pour Top (rank 5, no thermals): 50.22,23.35 52.05,23.35 52.05,23.11 50.22,23.11
  pour Top (rank 5, no thermals): 50.22,24.55 52.05,24.55 52.05,24.31 50.22,24.31
  pour Top (rank 5, no thermals): 50.22,28.15 52.05,28.15 52.05,27.91 50.22,27.91
  pour Top (rank 5, no thermals): 50.22,29.35 52.05,29.35 52.05,29.11 50.22,29.11
  pour Top (rank 5, no thermals): 50.22,30.55 52.05,30.55 52.05,30.31 50.22,30.31
  pour Top (rank 5, no thermals): 50.22,31.75 52.05,31.75 52.05,31.51 50.22,31.51
  pour Top (rank 5, no thermals): 50.22,32.95 52.05,32.95 52.05,32.71 50.22,32.71
  pour Top (rank 5, no thermals): 50.22,34.15 52.05,34.15 52.05,33.91 50.22,33.91
  pour Top (rank 5, no thermals): 53.02,31.75 54.45,31.75 54.45,31.51 53.02,31.51
  pour Top (rank 5, no thermals): 53.02,32.95 54.45,32.95 54.45,32.71 53.02,32.71
  pour Top (rank 5, no thermals): 53.02,34.15 54.85,34.15 54.85,33.91 53.02,33.91
  pour Top (rank 5, no thermals): 16.67,33 18.18,33 18.18,32.69 16.67,32.69
  pour Top (rank 5, no thermals): 16.67,34.2 17.78,34.2 17.78,33.89 16.67,33.89
  pour Bottom (rank 5, no thermals): 71.28,44.37 71.28,47.31 76.2,47.31 76.2,44.37
  pour Bottom (rank 5, no thermals): 71.28,51.75 71.28,54.69 76.2,54.69 76.2,51.75
  pour Top (rank 3, no thermals): 16.67,21.35 18.1,21.35 18.1,21.11 16.67,21.11
  pour Top (rank 5, no thermals): 16.67,22.54 18.1,22.54 18.1,22.3 16.67,22.3
  pour Top (rank 5, no thermals): 16.67,23.73 18.1,23.73 18.1,23.49 16.67,23.49
  pour Top (rank 5, no thermals): 16.67,24.92 18.1,24.92 18.1,24.68 16.67,24.68
N$1
  Bottom 0.254: C28.1 27.89,12.06 U8.1
N$2
  Bottom 0.254: U4.4 64.16,58.9 R10.1
N$4
  Bottom 0.254: U8.8 R24.2
N$5
  Bottom 0.254: U8.6 C27.1 R25.2
N$6
  Bottom 0.254: R25.1 36.67,15.88 36.88,16.09 C26.1
N$7
  Bottom 0.254: JP8.5 29.21,59.69 24.92,59.69 24.13,58.9 15,58.9 10.79,54.69 10.79,52.78 12.75,50.83 R8.1 13.41,50.09 14.45,49.05 14.45,43.02 16.83,40.64 U2.3
N$8  (via drill 0.35)
  Top 0.152: RPI1.182 54.58,19.24 55.88,17.94 55.88,10.49 56.56,9.81 v56.56,9.34
  Bottom 0.152: JP12.9 60.76,7.19 61,7.43 61,8.3 59.37,9.92 58.82,9.92 58.66,9.76 58.5,9.76 58.34,9.92 58.18,9.92 57.86,9.6 57.55,9.6 57.26,9.89 57.12,9.89 v56.56,9.34
N$9  (via drill 0.35)
  Top 0.152: v24.69,39.05 24.69,38.85 26.82,36.72 26.82,29.2 25.96,28.34 25.48,28.34 24.21,27.07 24.21,25.88 22.37,24.04 RPI1.58
  Top 0.254: v12.16,54.36 11.99,54.53 11.19,54.53 10.56,55.17 10.56,57.15 10.88,57.48 U1.3
  Bottom 0.254: JP8.3 26.67,57.15 24.77,57.15 23.97,57.94 15.34,57.94 12.16,54.76 v12.16,54.36 12.16,52.61 15.32,49.45 15.32,43.42 16.19,42.55 19.29,42.55 19.61,42.23 19.61,41.67 20.56,40.72 20.56,39.37 21.51,38.42 23.42,38.42 24.05,39.05 v24.69,39.05 25.97,39.05 26.29,39.37 U2.15 R1.1
N$10  (via drill 0.35)
  Top 0.152: RPI1.184 54.5,18.84 55.56,17.78 55.56,10.32 55.72,10.16 v55.72,9.53
  Bottom 0.152: v55.72,9.53 56.44,10.24 59.49,10.24 61.32,8.41 61.32,7.27 61.16,7.11 JP12.11
N$11  (via drill 0.35)
  Top 0.152: RPI1.176 54.81,20.44 56.52,18.73 56.52,10.79 56.67,10.64 57.07,10.64 57.23,10.48 57.23,10.08 57.31,10 57.71,10 57.86,9.84 57.86,9.45 57.94,9.37 58.26,9.37 58.42,9.21 58.42,8.18 59.93,6.67 59.93,6.61 arc90 60.2,6.34 60.45,6.34 arc-90 60.72,6.07 60.72,6.01 arc-90 60.45,5.74 60.2,5.74 arc90 59.93,5.48 59.93,4.45 v60.17,4.21
  Bottom 0.152: JP12.6 v60.16,4.21 v60.17,4.21
N$12  (via drill 0.35)
  Top 0.152: RPI1.178 54.73,20.04 56.2,18.57 56.2,10.68 58.12,8.76 58.12,8.05 59.51,6.66 59.51,3.73 59.9,3.33 v60.01,3.33
  Bottom 0.152: JP12.8 60.56,4.71 60.75,4.53 60.75,3.92 60.17,3.33 v60.01,3.33
N$13
  Bottom 0.406: SG1.- 43.02,51.76 45.4,49.38 45.4,49.05 D1.1 45.72,48.58 44.65,47.51 42.74,47.51 41.04,45.8 Q1.3
N$14  (via drill 0.35)
  Bottom 0.254: L1.1 31.27,23.16 v31.27,23.18 | C28.2 28.79,13.07 v28.89,13.18
  other vias: 29.53,16.19 28.89,14.13 28.89,14.92 28.89,15.72 30.32,16.19 31.27,21.91 30,23.18 30,21.91 30,20.64 31.27,20.64 29.53,16.91 30.32,16.91 28.81,16.91 32.54,20.64 32.54,21.91 32.54,23.18
  pour Bottom (isolate 0.254, rank 5, no thermals): 26.67,15.24 26.67,13.97 27.94,13.97 27.94,13.02 30.64,13.02 30.64,17.22 28.26,17.22 28.26,15.24
  pour Top (isolate 0.254, rank 5, no thermals): 30.64,19.05 27.94,19.05 27.3,18.41 27.3,12.7 29.21,12.7 29.21,15.56 30.64,15.56
  pour Top (isolate 0.254, rank 5): 27.94,15.72 27.94,21.59 29.92,23.57 32.7,23.57 33.02,23.26 33.02,20.32 30.64,17.94 30.64,15.72
N$15
  Bottom 0.254: U8.5 34.07,15.88 34.5,16.3 R27.2 34.53,17.49 R26.1
N$16  (via drill 0.35)
  Top 0.254: R6.1 36.01,51.2 R7.1 36.06,51.2 v39.37,51.2
  Bottom 0.254: v39.37,51.2 39.37,48.26 40.09,47.54 Q1.1
N$17  (via drill 0.35)
  Top 0.152: RPI1.170 55.75,21.64 57.15,20.24 57.15,11.7 58.85,10 59.21,10 59.64,9.58 59.64,8.76 59.29,8.41 v59.05,8.41
  Bottom 0.152: v59.05,8.41 59.29,8.18 59.29,7.46 59.56,7.19 JP12.3
N$18
  Top 0.152: J3.2 17.54,13.81 16.03,15.32 16.03,16.83 16.45,17.24 RPI1.91
N$19
  Top 0.152: RPI1.89 15,17.64 J2.2
N$20
  Bottom 0.254: BATT1.B+ 27.21,54.07 30.48,50.8 30.48,40.88 30.27,40.67 C3.1 29.66,40.64 U2.14
N$21  (via drill 0.35)
  Top 0.152: RPI1.172 54.8,21.24 55.16,20.88 arc90 55.54,20.88 55.59,20.94 arc-90 55.97,20.94 55.97,20.93 arc-90 55.97,20.56 55.92,20.5 arc90 55.92,20.12 55.92,20.12 arc90 56.3,20.12 56.35,20.18 arc-90 56.73,20.18 56.73,20.18 arc-90 56.73,19.8 56.67,19.75 arc90 56.67,19.37 56.83,19.21 56.83,11.59 59.05,9.37 v59.05,9.29
  Bottom 0.152: v59.05,9.29 59.29,9.29 59.64,8.94 59.64,7.59 59.96,7.27 JP12.5
N$22
  Top 0.254: JP8.2 24.13,59.69 R4.1
N$23  (via drill 0.35)
  Top 0.152: RPI1.188 54.83,18.04 55.24,17.62 55.24,13.57 54.53,12.86 54.53,12.49 arc90 54.8,12.23 54.98,12.23 arc-90 55.24,11.96 55.24,11.88 arc-90 54.98,11.62 54.8,11.62 arc90 54.53,11.35 54.53,11.19 54.69,11.03 54.69,10.79 54.53,10.64 54.53,9.84 55.64,8.73 57,8.73 59.2,6.53 59.2,3.32 59.85,2.67 60.85,2.67 v61.28,3.1
  Bottom 0.152: JP12.12 61.36,3.57 61.28,3.49 v61.28,3.1
N$24  (via drill 0.35)
  Top 0.152: v24.21,38.26 24.84,38.26 26.51,36.59 26.51,29.37 25.8,28.65 25.32,28.65 23.89,27.23 23.89,26.04 22.3,24.44 RPI1.56
  Top 0.254: v11.51,53.58 10.08,55.01 10.08,57.31 10.9,58.12 U1.4
  Bottom 0.254: JP8.1 15.24,58.42 11.51,54.69 v11.51,53.58 11.51,52.67 14.86,49.32 14.86,43.25 16.83,41.27 19.37,41.27 20.08,40.56 20.08,39.13 21.27,37.94 23.89,37.94 v24.21,38.26 25.96,38.26 26.11,38.1 U2.16 R2.1
N$25  (via drill 0.35)
  Top 0.152: RPI1.190 54.75,17.64 54.93,17.46 54.93,13.73 54.21,13.02 54.21,9.73 55.52,8.43 56.88,8.43 58.9,6.41 58.9,3.19 59.72,2.37 61.06,2.37 61.15,2.46 61.9,2.46 v61.98,2.54
  Bottom 0.152: v61.98,2.54 61.98,3.41 61.76,3.63 JP12.14
N$26  (via drill 0.35)
  Top 0.152: RPI1.21 16.56,31.24 16.35,31.04 16.35,29.61 v16.03,29.29 | v23.34,30.24 23.65,30.56 24.84,30.56 25.24,30.96 25.24,35.96 24.53,36.67 23.42,36.67 22.54,37.54 22.54,39.69 24.37,41.51 24.37,51.04 v23.97,51.44 | v25.72,51.44 26.83,51.44 27.55,52.15 28.5,52.15 30.72,54.37 R11.1
  Bottom 0.152: v16.03,29.29 17.78,29.29 18.41,29.92 23.02,29.92 v23.34,30.24
  Bottom 0.254: v25.72,51.44 v23.97,51.44
N$27  (via drill 0.35)
  Top 0.152: RPI1.95 18.11,16.44 18.41,16.75 18.41,20.53 18.67,20.78 18.67,25.15 v18.51,25.31 | v25.72,27.07 25.72,27.15 27.46,28.89 27.46,36.99 25.64,38.81 25.64,49.29 27.86,51.51 28.89,51.51 29.84,52.47 32.31,52.47 32.54,52.7 32.54,53.34
  Top 0.254: 32.54,53.34 34.45,55.24 43.1,55.24 47.55,59.69 58.82,59.69 v59.21,59.29
  Bottom 0.152: v18.51,25.31 18.51,25.55 19.14,26.18 19.14,27 19.53,27.38 25.4,27.38 v25.72,27.07
  Bottom 0.254: v59.21,59.29 60.09,58.42 60.09,56.83 60.72,56.2 61.56,56.2 U4.1
N$28  (via drill 0.35)
  Top 0.152: RPI1.99 17.3,15.58 17.3,15.08 18.41,13.97 18.41,9.21 18.34,9.13 v18.34,8.97
  Top 0.254: v13.49,7.7 13.49,5.24 12.06,3.81 4.35,3.81 JP9.1
  Bottom 0.254: v18.34,8.97 14.76,8.97 v13.49,7.7
N$29  (via drill 0.35)
  Top 0.152: RPI1.93 16.52,16.84 16.35,16.67 16.35,15.48 18.1,13.73 18.1,10.24 v17.78,9.92
  Top 0.254: v13.49,9.6 13.02,9.6 12.12,10.51 SW3.4
  Bottom 0.254: v17.78,9.92 17.3,9.45 13.65,9.45 v13.49,9.6
N$30  (via drill 0.35)
  Top 0.254: v10.64,25.8 10.64,25.44 LED4.A
  Bottom 0.254: v10.64,25.8 10.64,26.22 R21.1
N$31
  Bottom 0.406: D2.1 41.17,48.1 42.39,48.1 43.02,48.74 D1.2
N$34  (via drill 0.35)
  Top 0.152: RPI1.92 21.29,17.24 v21.83,17.78
  Top 0.254: v25.48,23.89 25.8,23.89 29.53,27.62 29.53,41.43 32.94,44.85 40.96,44.85 45.88,49.77 45.88,55.24 48.74,58.1 55.64,58.1 57.39,56.36 57.39,53.02 57.94,52.47 67.61,52.47 SW2.B'
  Bottom 0.254: v21.83,17.78 24.05,17.78 25.48,19.21 v25.48,23.89
N$35
  pour Bottom (isolate 0.254, rank 5, no thermals): 50.4,42.7 50.4,44.85 49.69,45.56 47.39,45.56 47.39,44.85 48.89,44.85 49.45,44.29 49.45,42.7
N$36
  Bottom 0.152: U5.31 53.07,43.7 53.98,44.61 R16.2
N$37
  Bottom 0.152: U5.29 52.27,44.68 52.57,44.98 52.96,44.98 53.1,45.12 53.1,46.34 X1.1
  Bottom 0.254: X1.1 53.49,47.05 C19.1
N$38
  Bottom 0.152: X1.3 51.28,44.88 51.87,44.29 U5.28
  Bottom 0.254: C20.1 50.24,46.54 50.97,45.81 51.12,45.81 X1.3
N$40
  Bottom 0.152: U5.1 54.39,42.67 54.7,42.99 55.59,42.99 58.41,40.17 59.84,40.17 60,40.01 JP11.2
N$41  (via drill 0.35)
  Top 0.254: v47.62,47.47 47.62,54.61 49.37,56.36 54.61,56.36 56.44,54.53 56.44,48.5 v56.67,48.26
  Bottom 0.152: U5.25 50.67,44.5 47.7,47.47 v47.62,47.47
  Bottom 0.254: v56.67,48.26 56.67,48.02 55.96,47.31 55.96,46.67 56.36,46.28 57.07,46.28 57.31,46.51 60.99,46.51 R15.2
N$42  (via drill 0.35)
  Top 0.254: v48.58,47.47 48.58,47.86 48.1,48.34 48.1,54.45 49.53,55.88 54.45,55.88 55.96,54.37 55.96,47.62 56.59,46.99 v56.67,46.99
  Bottom 0.152: v48.58,47.47 48.58,47.07 51.07,44.58 U5.26
  Bottom 0.254: v56.67,46.99 R14.2
N$44
  Bottom 0.152: U5.2 54.47,42.27 54.86,42.67 55.44,42.67 55.88,42.23 55.88,41.91 56.04,41.75 56.36,41.75 56.52,41.59 56.52,41.27 56.67,41.12 56.99,41.12 58.26,39.85 59.69,39.85 59.85,39.69 59.85,39.45 59.14,38.74 JP11.3
N$45
  Bottom 0.152: U5.4 55.68,41.48 57.94,39.21 57.94,38.34 58.66,37.62 59.85,37.62 60.96,38.73 63.82,38.73 64.06,38.5 64.06,37.39 63.82,37.15 63.18,37.15 62.86,37.47 JP11.4
N$46
  Bottom 0.152: U5.5 55.6,41.08 57.63,39.05 57.63,38.18 58.5,37.31 59.85,37.31 60.96,36.2 61.91,36.2 62.71,35.4 62.71,34.45 61.91,33.66 JP11.7
N$47
  Bottom 0.152: U5.6 55.53,40.67 55.96,40.24 55.96,39.53 arc90 56.23,39.26 56.77,39.26 arc-90 57.03,38.99 57.03,38.96 arc-90 56.77,38.69 56.23,38.69 arc90 55.96,38.42 55.96,38.18 56.2,37.94 arc90 56.57,37.94 arc-90 56.95,37.94 56.96,37.93 arc-90 56.96,37.55 arc90 56.96,37.17 57.07,37.06 arc90 57.45,37.06 arc-90 57.83,37.06 57.86,37.03 arc-90 57.86,36.65 arc90 57.86,36.27 57.94,36.2 JP11.5
N$48
  Bottom 0.152: U5.7 55.45,40.27 55.64,40.08 55.64,38.02 58.74,34.92 JP11.6
N$49
  Bottom 0.152: JP11.8 59.92,32.39 59.76,32.55 58.41,32.55 57.94,33.02 57.94,35.24 54.69,38.5 53.9,38.5 53.47,38.92 U5.9
N$50
  Bottom 0.152: U5.10 53.07,38.85 53.74,38.18 54.53,38.18 57.63,35.08 57.63,32.86 58.26,32.23 59.61,32.23 59.77,32.07 59.77,31.84 JP11.9
N$51
  Top 0.254: JP8.4 26.67,59.69 26.67,57.78 25.56,56.67 R5.1
N$52  (via drill 0.35)
  Top 0.152: RPI1.61 16.53,23.24 15.81,22.53 14.43,22.53 13.33,21.43 13.33,15 15.4,12.94 15.4,7.62 v16.11,6.91
  Bottom 0.254: SD1.2 14.58,2.3 15.21,2.92 16.23,2.92 17.6,4.3 17.6,6.49 18.34,7.22 18.34,7.94 18.02,8.26 17.3,8.26 16.11,7.06 v16.11,6.91
N$53
  Bottom 0.152: U5.18 49.56,40.27 48.26,38.97 48.26,38.81 48.26,38.71 C9.2
N$54  (via drill 0.35)
  Top 0.152: v52.55,32.7 52.81,32.44 RPI1.116
  Bottom 0.152: v52.55,32.7 52.31,32.46 51.91,32.46 51.41,32.96 arc-90 51.41,33.34 51.61,33.54 arc90 51.61,33.92 51.6,33.94 arc90 51.22,33.94 51.02,33.73 arc-90 50.64,33.73 48.66,35.72 48.66,36.83 48.66,36.99 48.66,37.09 C8.1
N$55  (via drill 0.35)
  Top 0.152: v19.08,8.34 19.08,9.21 18.73,9.55 18.73,20.4 19.01,20.67 19.01,23 19.24,23.24 RPI1.62
  Bottom 0.254: v19.08,8.34 19.08,7.38 18.06,6.37 18.06,4.17 16.35,2.46 15.92,2.46 15.68,2.22 SD1.3
N$56  (via drill 0.35)
  Top 0.152: v21.03,6.03 20.48,6.59 17.38,6.59 15.72,8.26 15.72,13.1 13.65,15.16 13.65,21.27 14.58,22.2 15.97,22.2 16.6,22.84 RPI1.63
  Bottom 0.254: SD1.7 20.08,2.3 20.72,2.94 20.72,4.92 21.03,5.24 v21.03,6.03
N$57  (via drill 0.35)
  Top 0.406: v55.01,39.69 C14.1 | v55.17,42.07 C15.1 | C14.1 54.19,40.85 54.35,41.01 C15.1 | v52.86,44.37 52.92,44.32 C13.1 53,43.58 54.35,42.23 C15.1 | v49.13,41.59 49.87,41.59 C16.1 49.95,41.09 52.15,38.89 53.74,38.89 54.19,39.34 C14.1
  Bottom 0.152: v55.01,39.69 54.82,39.88 U5.8 | U5.3 54.55,41.88 54.74,42.07 v55.17,42.07 | v52.86,44.37 52.67,44.18 U5.30 | U5.22 49.42,41.88 v49.13,41.59
  Bottom 0.406: v49.13,41.59 48.5,41.59 47.62,40.72 C18.1 C17.1 47.12,41.99 47.12,42.74 46.87,42.98 L2.P$1
N$58
  Bottom 0.254: JP10.12 70.93,19.53 66.52,19.53 60.17,25.88 55.85,25.88 R12.1
N$59
  Bottom 0.254: JP11.1 59.05,42.78 58.71,43.12 C7.1
N$60
  Bottom 0.254: JP10.1 57.78,22.23 57.23,22.78 C6.1
N$61
  Top 0.152: RPI1.20 20.82,31.64 21.09,31.91 J4.2
N$62
  Bottom 0.254: R13.1 60.01,25.4 66.36,19.05 69.85,19.05 70.8,18.1 70.8,11.08 JP10.14
N$63
  Bottom 0.254: USB1.VBUS 70.46,50.83 70.09,51.2
  Bottom 0.406: 66.52,51.44 65.83,51.44 C5.1 64.2,51.41 U3.6
  Bottom 0.61: 66.52,51.44 69.85,51.44 70.09,51.2
N$64  (via drill 0.35)
  Top 0.152: RPI1.76 19.25,20.44 19.05,20.24 19.05,11.59 v19.37,11.27
  Bottom 0.254: v19.37,11.27 19.05,11.59 11.44,11.59 SD1.CD2
N$65  (via drill 0.35)
  Top 0.152: RPI1.151 50.16,25.24 49.21,24.29 49.21,13.73 50.24,12.7 v50.24,11.43
  Bottom 0.152: v50.24,11.43 53.07,11.43 53.95,10.54 59.61,10.54 61.48,8.68 62.31,8.68 62.67,8.31 62.67,7.75 61.96,7.03 JP12.15
N$66  (via drill 0.35)
  Top 0.152: RPI1.200 53.88,14.37 52.7,13.19 v52.7,12.22
  Bottom 0.152: JP12.17 62.36,6.95 62.98,7.57 62.98,8.44 62.44,8.98 61.6,8.98 59.74,10.85 54.08,10.85 v52.7,12.22 | v52.7,12.22
N$67  (via drill 0.35)
  Top 0.152: v62.88,3.88 63.18,3.57 63.18,1.83 62.47,1.11 60.48,1.11 58.18,3.41 57.23,3.41 56.36,4.29 56.36,5.64 51.24,10.75 RPI1.199
  Bottom 0.152: JP12.18 62.56,4.19 v62.88,3.88
N$68  (via drill 0.35)
  Top 0.152: RPI1.153 50.24,24.84 49.53,24.13 49.53,13.89 50.88,12.54 50.88,9.68 v50.96,9.6
  Bottom 0.152: JP12.1 58.69,6.47 58.5,6.67 56.28,6.67 53.66,9.29 51.28,9.29 v50.96,9.6
N$69  (via drill 0.35)
  Top 0.152: RPI1.75 16.55,20.44 15.8,21.19 15,21.19 14.76,20.95 14.76,19.13 v14.92,18.97
  Top 0.254: v23.57,19.53 23.57,19.92 29.92,26.27 31.91,26.27 36.91,21.27 36.91,20.4 37.46,19.84 v38.58,19.84
  Bottom 0.254: v14.92,18.97 15.56,18.34 17.78,18.34 18.97,19.53 v23.57,19.53 | v38.58,19.84 38.58,19.53 42.28,15.82 R17.1 42.28,14.82 41.86,14.39 U6.3
N$70  (via drill 0.35)
  Top 0.152: v55.09,35.48 54.85,35.24 RPI1.102
  Bottom 0.152: U5.12 52.27,38.7 52.07,38.5 52.07,37.94 52.47,37.54 53.02,37.54 v55.09,35.48
N$71  (via drill 0.35)
  Top 0.152: RPI1.103 52.06,34.84 53.74,36.51 55.64,36.51 57.07,37.94 57.07,42.31 58.02,43.26 59.29,43.26 60.32,44.29 60.32,46.43 63.9,50.01 66.99,50.01 67.07,50.09 67.39,50.09 67.47,50.01 69.53,50.01 v69.85,50.32
  Bottom 0.152: USB1.D- 69.99,50.18 v69.85,50.32
N$72  (via drill 0.35)
  Top 0.152: RPI1.105 52.14,34.44 53.9,36.2 55.8,36.2 57.39,37.78 57.39,42.15 58.18,42.94 59.45,42.94 60.64,44.13 60.64,46.28 64.06,49.69 69.53,49.69 v69.85,49.37
  Bottom 0.152: USB1.D+ 70.01,49.53 v69.85,49.37
N$73  (via drill 0.35)
  Top 0.152: 50.24,35.24 RPI1.101
  Top 0.254: v48.58,31.83 47.94,31.83 47.07,32.7 47.07,34.29 48.02,35.24 50.24,35.24 | v63.5,41.27 61.67,43.1 61.67,45.64 64.21,48.18 v68.82,48.18
  Bottom 0.152: USB1.ID 70.31,48.88 70.17,48.74 69.37,48.74 v68.82,48.18
  Bottom 0.254: v48.58,31.83 49.69,31.83 52.78,28.73 58.9,28.73 59.69,27.94 62.07,27.94 63.5,29.37 63.5,29.84 66.04,32.38 66.04,38.73 v63.5,41.27
N$74  (via drill 0.35)
  Top 0.152: v48.66,33.5 48.8,33.64 RPI1.109
  Bottom 0.152: U5.19 49.49,40.67 48.02,39.21 47.7,39.21 47.23,38.73 47.23,34.92 v48.66,33.5
N$75  (via drill 0.35)
  Top 0.152: v55.09,33.89 54.83,33.64 RPI1.110
  Bottom 0.152: v55.09,33.89 54.85,33.66 54.37,33.66 54.13,33.89 arc-90 54.13,34.27 arc90 54.13,34.65 54.13,34.66 arc90 53.75,34.66 arc-90 53.37,34.66 51.07,36.96 U5.15
N$76  (via drill 0.35)
  Top 0.152: v55.09,33.02 54.87,33.24 RPI1.112
  Bottom 0.152: v55.09,33.02 55.01,33.02 54.69,33.34 54.21,33.34 50.67,36.88 U5.16
N$77
  Bottom 0.152: U5.17 49.64,39.88 48.74,38.97 48.74,38.81 48.74,38.71 C8.2
N$78  (via drill 0.35)
  Top 0.152: v52.55,31.83 52.76,32.04 RPI1.118
  Bottom 0.152: v52.55,31.83 52.47,31.83 52.15,32.15 51.75,32.15 48.34,35.56 48.34,36.83 48.34,36.99 48.34,37.09 C9.1
N$79  (via drill 0.35)
  Top 0.152: v55.09,31.27 55.05,31.24 RPI1.122
  Bottom 0.152: U5.13 51.87,38.8 51.71,38.64 51.71,37.27 51.87,37.11 arc90 52.25,37.11 52.3,37.15 arc-90 52.67,37.15 52.67,37.15 arc-90 52.67,36.78 52.63,36.73 arc90 52.63,36.35 52.66,36.31 arc90 53.04,36.31 53.1,36.37 arc-90 53.48,36.37 53.51,36.34 arc-90 53.51,35.96 53.45,35.9 arc90 53.45,35.52 53.5,35.48 54.21,35.48 54.85,34.85 55.56,34.85 56.04,34.37 56.04,32.23 v55.09,31.27
N$80  (via drill 0.35)
  Top 0.152: v55.09,30.32 54.57,30.84 RPI1.124
  Bottom 0.152: U5.14 51.47,38.88 51.39,38.8 51.39,37.11 53.34,35.16 54.05,35.16 54.69,34.53 55.4,34.53 55.72,34.21 55.72,32.78 54.45,31.51 54.45,30.96 v55.09,30.32
N$81  (via drill 0.35)
  Top 0.152: RPI1.12 23.16,33.24 v23.89,33.97
  Bottom 0.152: JP10.2 60.04,20.96 59.88,21.11 58.45,21.11 57.42,20.09 57.42,18.76 56.99,18.33 48.22,18.33 48.07,18.48 46.45,18.48 31.25,33.68 24.18,33.68 v23.89,33.97
N$82  (via drill 0.35)
  Top 0.152: RPI1.10 22.61,33.64 v23.02,34.05
  Bottom 0.152: JP10.3 59.85,20.49 59.85,20.64 59.68,20.81 58.58,20.81 57.73,19.96 57.73,18.63 57.12,18.02 48.1,18.02 47.94,18.18 47.78,18.18 47.63,18.02 47.46,18.02 47.31,18.18 47.15,18.18 46.99,18.02 46.48,18.02 31.12,33.38 23.45,33.38 23.02,33.81 v23.02,34.05
N$83  (via drill 0.35)
  Top 0.152: v22.15,34.29 22.15,34.37 21.6,34.92 20.83,34.92 20.75,34.84 RPI1.4
  Bottom 0.152: v22.15,34.29 22.15,33.89 22.97,33.07 30.99,33.07 46.35,17.72 57.24,17.72 58.1,18.57 59.85,18.57 60.96,19.68 63.66,19.68 63.9,19.45 63.9,18.34 63.66,18.1 63.1,18.1 62.78,18.42 JP10.4
N$84  (via drill 0.35)
  Top 0.152: RPI1.6 21.12,34.44 v21.27,34.29
  Bottom 0.152: JP10.7 61.92,14.61 62.71,15.4 62.71,16.35 61.91,17.14 60.88,17.14 59.77,18.26 58.26,18.26 57.42,17.41 46.23,17.41 30.87,32.77 22.71,32.77 21.27,34.21 v21.27,34.29
N$85  (via drill 0.35)
  Top 0.152: RPI1.11 18.2,33.24 v18.65,32.78
  Bottom 0.152: v18.65,32.78 18.97,32.46 19.24,32.46 arc90 19.51,32.73 19.51,33.23 arc-90 19.77,33.5 19.79,33.5 arc-90 20.06,33.23 20.06,32.73 arc90 20.33,32.46 20.35,32.46 arc90 20.61,32.73 20.61,33.23 arc-90 20.88,33.5 20.9,33.5 arc-90 21.16,33.23 21.16,32.73 arc90 21.43,32.46 30.74,32.46 46.1,17.11 56.08,17.11 arc-90 56.34,16.84 56.34,16.72 arc90 56.61,16.45 56.63,16.45 arc90 56.89,16.72 56.89,16.84 arc-90 57.16,17.11 57.18,17.11 arc-90 57.44,16.84 57.44,16.72 arc90 57.71,16.45 57.73,16.45 arc90 57.99,16.72 57.99,16.84 arc-90 58.26,17.11 59.01,17.11 JP10.5
N$86  (via drill 0.35)
  Top 0.152: RPI1.9 18.48,33.64 v18.57,33.73
  Bottom 0.152: v18.57,33.73 17.94,33.1 17.94,32.46 18.26,32.15 30.63,32.15 45.97,16.8 55.7,16.8 56.62,15.88 JP10.6
N$87  (via drill 0.35)
  Top 0.152: RPI1.3 16.36,34.84 v16.11,35.08
  Bottom 0.152: JP10.8 59.92,13.34 59.76,13.5 58.57,13.5 55.57,16.5 45.85,16.5 30.51,31.83 18.1,31.83 17.62,32.31 17.62,34.29 17.15,34.77 16.51,34.77 16.19,35.08 v16.11,35.08
N$88  (via drill 0.35)
  Top 0.152: RPI1.5 16.34,34.44 v16.11,34.21
  Bottom 0.152: v16.11,34.21 16.35,34.45 16.91,34.45 17.3,34.05 17.3,32.15 17.94,31.51 30.4,31.51 45.72,16.19 45.96,16.19 46.12,16.03 46.28,16.03 46.43,16.19 46.59,16.19 46.75,16.03 46.91,16.03 47.07,16.19 47.23,16.19 47.39,16.03 47.55,16.03 47.7,16.19 47.86,16.19 48.02,16.03 48.18,16.03 48.34,16.19 48.5,16.19 48.66,16.03 48.82,16.03 48.97,16.19 55.4,16.19 58.42,13.18 59.61,13.18 59.77,13.02 59.77,12.79 JP10.9
N$89
  Bottom 0.152: JP12.19 63.08,6.47
  Bottom 0.254: 63.08,6.47 63.59,6.99 64.93,6.99 65.8,6.11 65.8,4.05 65.17,3.41 63.58,3.41 63.1,2.94 63.1,1.59 62.47,0.95 60.32,0.95 58.9,2.38 58.9,2.78 58.26,3.41 56.99,3.41 56.44,3.97 56.44,5.79
  Bottom 0.406: 56.44,5.79 53.42,8.81 49.77,8.81 47.31,6.35 45.72,6.35 44.98,7.09 C24.1 44.98,9.62 U7.6
N$90
  Bottom 0.254: 20.4,8.1 18.49,6.19 18.49,4 16.78,2.29 SD1.4
  Bottom 0.406: U6.6 38.47,11.8 36.12,9.45 27.07,9.45 25.59,10.92 C22.1 24.18,11.35 21.27,11.35 20.4,10.48 20.4,8.1
N$91  (via drill 0.35)
  Top 0.152: RPI1.49 18.02,25.64 18.49,26.11 v18.49,26.43 | v26.67,27.23 26.67,27.62 27.78,28.73 27.78,37.15 25.96,38.97 25.96,49.13 28.02,51.2 R6.2
  Bottom 0.152: v18.49,26.43 18.49,26.83 19.37,27.7 26.19,27.7 v26.67,27.23
N$92  (via drill 0.35)
  Top 0.152: v24.69,40.01 24.29,40.01 23.49,39.21 23.49,38.02 23.89,37.62 25,37.62 26.19,36.43 26.19,29.53 25.64,28.97 25.16,28.97 23.57,27.38 23.57,26.19 22.22,24.84 RPI1.54
  Top 0.254: v31.12,44.05 31.51,44.05 32.78,45.32 40.72,45.32 45.4,50.01 45.4,55.4 48.58,58.58 55.8,58.58 57.84,56.54 57.84,54.6 SW1.B'
  Bottom 0.254: v31.12,44.05 30.96,43.89 30.96,40.72 30.24,40.01 v24.69,40.01
N$93
  Bottom 0.254: R14.1 64.05,46.99 65.16,45.88 67.71,45.88 70.72,42.86 70.72,40.95 JP11.12
N$94
  Bottom 0.254: R15.1 64.69,45.72 65,45.4 67.55,45.4 70.25,42.7 70.25,40.76 70.74,40.27 70.74,30.19 JP11.14
N$95  (via drill 0.35)
  Top 0.152: RPI1.55 14.77,24.44 13.89,25.32 v13.89,25.64 | v24.29,29.92 24.69,29.92 25.56,30.8 25.56,36.12 24.69,36.99 23.57,36.99 22.86,37.7 22.86,39.53 24.69,41.35 24.69,52.97 R4.2
  Bottom 0.152: v13.89,25.64 13.89,25.72 15.08,26.91 15.88,26.91 18.57,29.61 23.97,29.61 v24.29,29.92
N$96  (via drill 0.35)
  Top 0.152: RPI1.51 16.35,25.24 v15.32,26.27 | v25.24,29.61 25.24,30 25.88,30.64 25.88,36.27 24.84,37.31 23.73,37.31 23.18,37.86 23.18,39.37 25,41.2 25,52.97 R5.2
  Bottom 0.152: v25.24,29.61 24.92,29.29 18.73,29.29 15.72,26.27 v15.32,26.27
N$97  (via drill 0.35)
  Top 0.152: RPI1.15 16.61,32.44 15.48,33.58 15.48,35.88 16.03,36.43 v16.03,37.31
  Bottom 0.254: v16.03,37.31 16.43,36.91 16.83,36.91 17.46,36.27 27.54,36.27 27.86,35.96 31.04,35.96 45.01,21.99 48.66,21.99 52.55,25.88 53.37,25.88 R12.2
N$98  (via drill 0.35)
  Top 0.152: RPI1.17 16.58,32.04 15.17,33.45 15.17,36.58 v15.16,36.59
  Bottom 0.254: R13.2 52.7,25.4 48.82,21.51 44.85,21.51 30.88,35.48 27.7,35.48 27.38,35.8 17.3,35.8 16.67,36.43 15.32,36.43 v15.16,36.59
N$100  (via drill 0.35)
  Top 0.152: v21.51,6.91 17.54,6.91 16.03,8.41 16.03,13.26 13.97,15.32 13.97,21.11 14.74,21.88 16.29,21.88 16.45,22.04 RPI1.67
  Bottom 0.254: v21.51,6.91 21.75,6.67 21.75,5.32 21.18,4.75 SD1.8
N$101  (via drill 0.35)
  Top 0.152: v19.21,5.87 18.81,6.27 15.88,6.27 15.08,7.06 15.08,12.78 13.02,14.84 13.02,21.59 14.29,22.86 14.29,23.57 14.75,24.04 RPI1.57
  Bottom 0.254: SD1.5 17.88,2.72 18.97,3.81 18.97,5.64 v19.21,5.87
N$102  (via drill 0.35)
  Top 0.152: RPI1.69 16.53,21.64 16.45,21.56 14.89,21.56 14.29,20.95 14.29,15.48 16.35,13.41 16.35,8.97 v17.7,7.62
  Bottom 0.254: SD1.1 13.48,2.3 14.57,3.39 16.1,3.39 17.14,4.43 17.14,6.66 17.7,7.22 v17.7,7.62
N$103  (via drill 0.35)
  Top 0.152: RPI1.28 21.08,30.04 21.99,29.13 v21.99,26.75 | v24.84,26.75 24.84,27.23 25.64,28.02 26.11,28.02 27.15,29.05 27.15,36.83 25.32,38.66 25.32,49.45 27.71,51.83 28.66,51.83 29.93,53.1 R3.1
  Bottom 0.152: v24.84,26.75 24.53,27.07 22.3,27.07 v21.99,26.75
N$104
  Bottom 0.254: U3.5 65.78,52.39 R9.1
N$105
  Bottom 0.254: R20.1 45.98,9.63 U7.5
N$106
  Top 0.254: LED1.C 59.33,60.17 47.39,60.17 42.94,55.72 34.34,55.72 R3.2
N$107
  Top 0.254: LED3.C 62.11,59.93 60.17,59.93 59.45,60.64 47.15,60.64 42.7,56.2 34.13,56.2 32.3,54.37 R11.2
N$108
  Bottom 0.254: R18.1 40.19,11.78 U6.5
N$110  (via drill 0.35)
  Top 0.254: v21.19,9.53 21.59,9.92 R19.2
  Bottom 0.254: SD1.CD1 21.36,9.53 v21.19,9.53
N$111  (via drill 0.35)
  Top 0.254: v65.41,60.25 LED2.C
  Bottom 0.254: R10.2 64.77,59.61 v65.41,60.25
REG_EN  (via drill 0.35)
  Top 0.254: v33.1,10.24 24.29,10.24 22.78,8.73 22.78,5.48 21.83,4.52 13.41,4.52 12.22,3.33 8.89,3.33 8.41,3.33 7.87,3.33 JP9.3
  Bottom 0.254: R22.1 32.15,10.72 | 32.15,10.72 32.62,10.72 v33.1,10.24 | 32.15,10.72 32.15,11.27 32.31,11.43 32.31,12.36 U8.7 R23.2

## Text on the board
tPlace: TX | RX | GND | GND | 5V | SCL | SDA | INT | GND | 3V3 | 12V | SHUTDOWN | RST/BOOT | 1.1 220420 | WIFI | zakkemble.net | SWITCH | MODEM | ETH1 / WAN | WP | SERVER | 12V IN | ETH0 / LAN | WL | BT | 5V | BOOT | HDMI | GEN | REN
bPlace: 2.5mm
tStop: RouterPi